# EasyEDA schematic SCH_CourseWorkMk_2022-09-30(2).json
TITLE: Sheet_1; REV: 1.0; Date: 2022-09-30; Sheet: 1/1; Drawn By: fzastahov; Company: Your Company
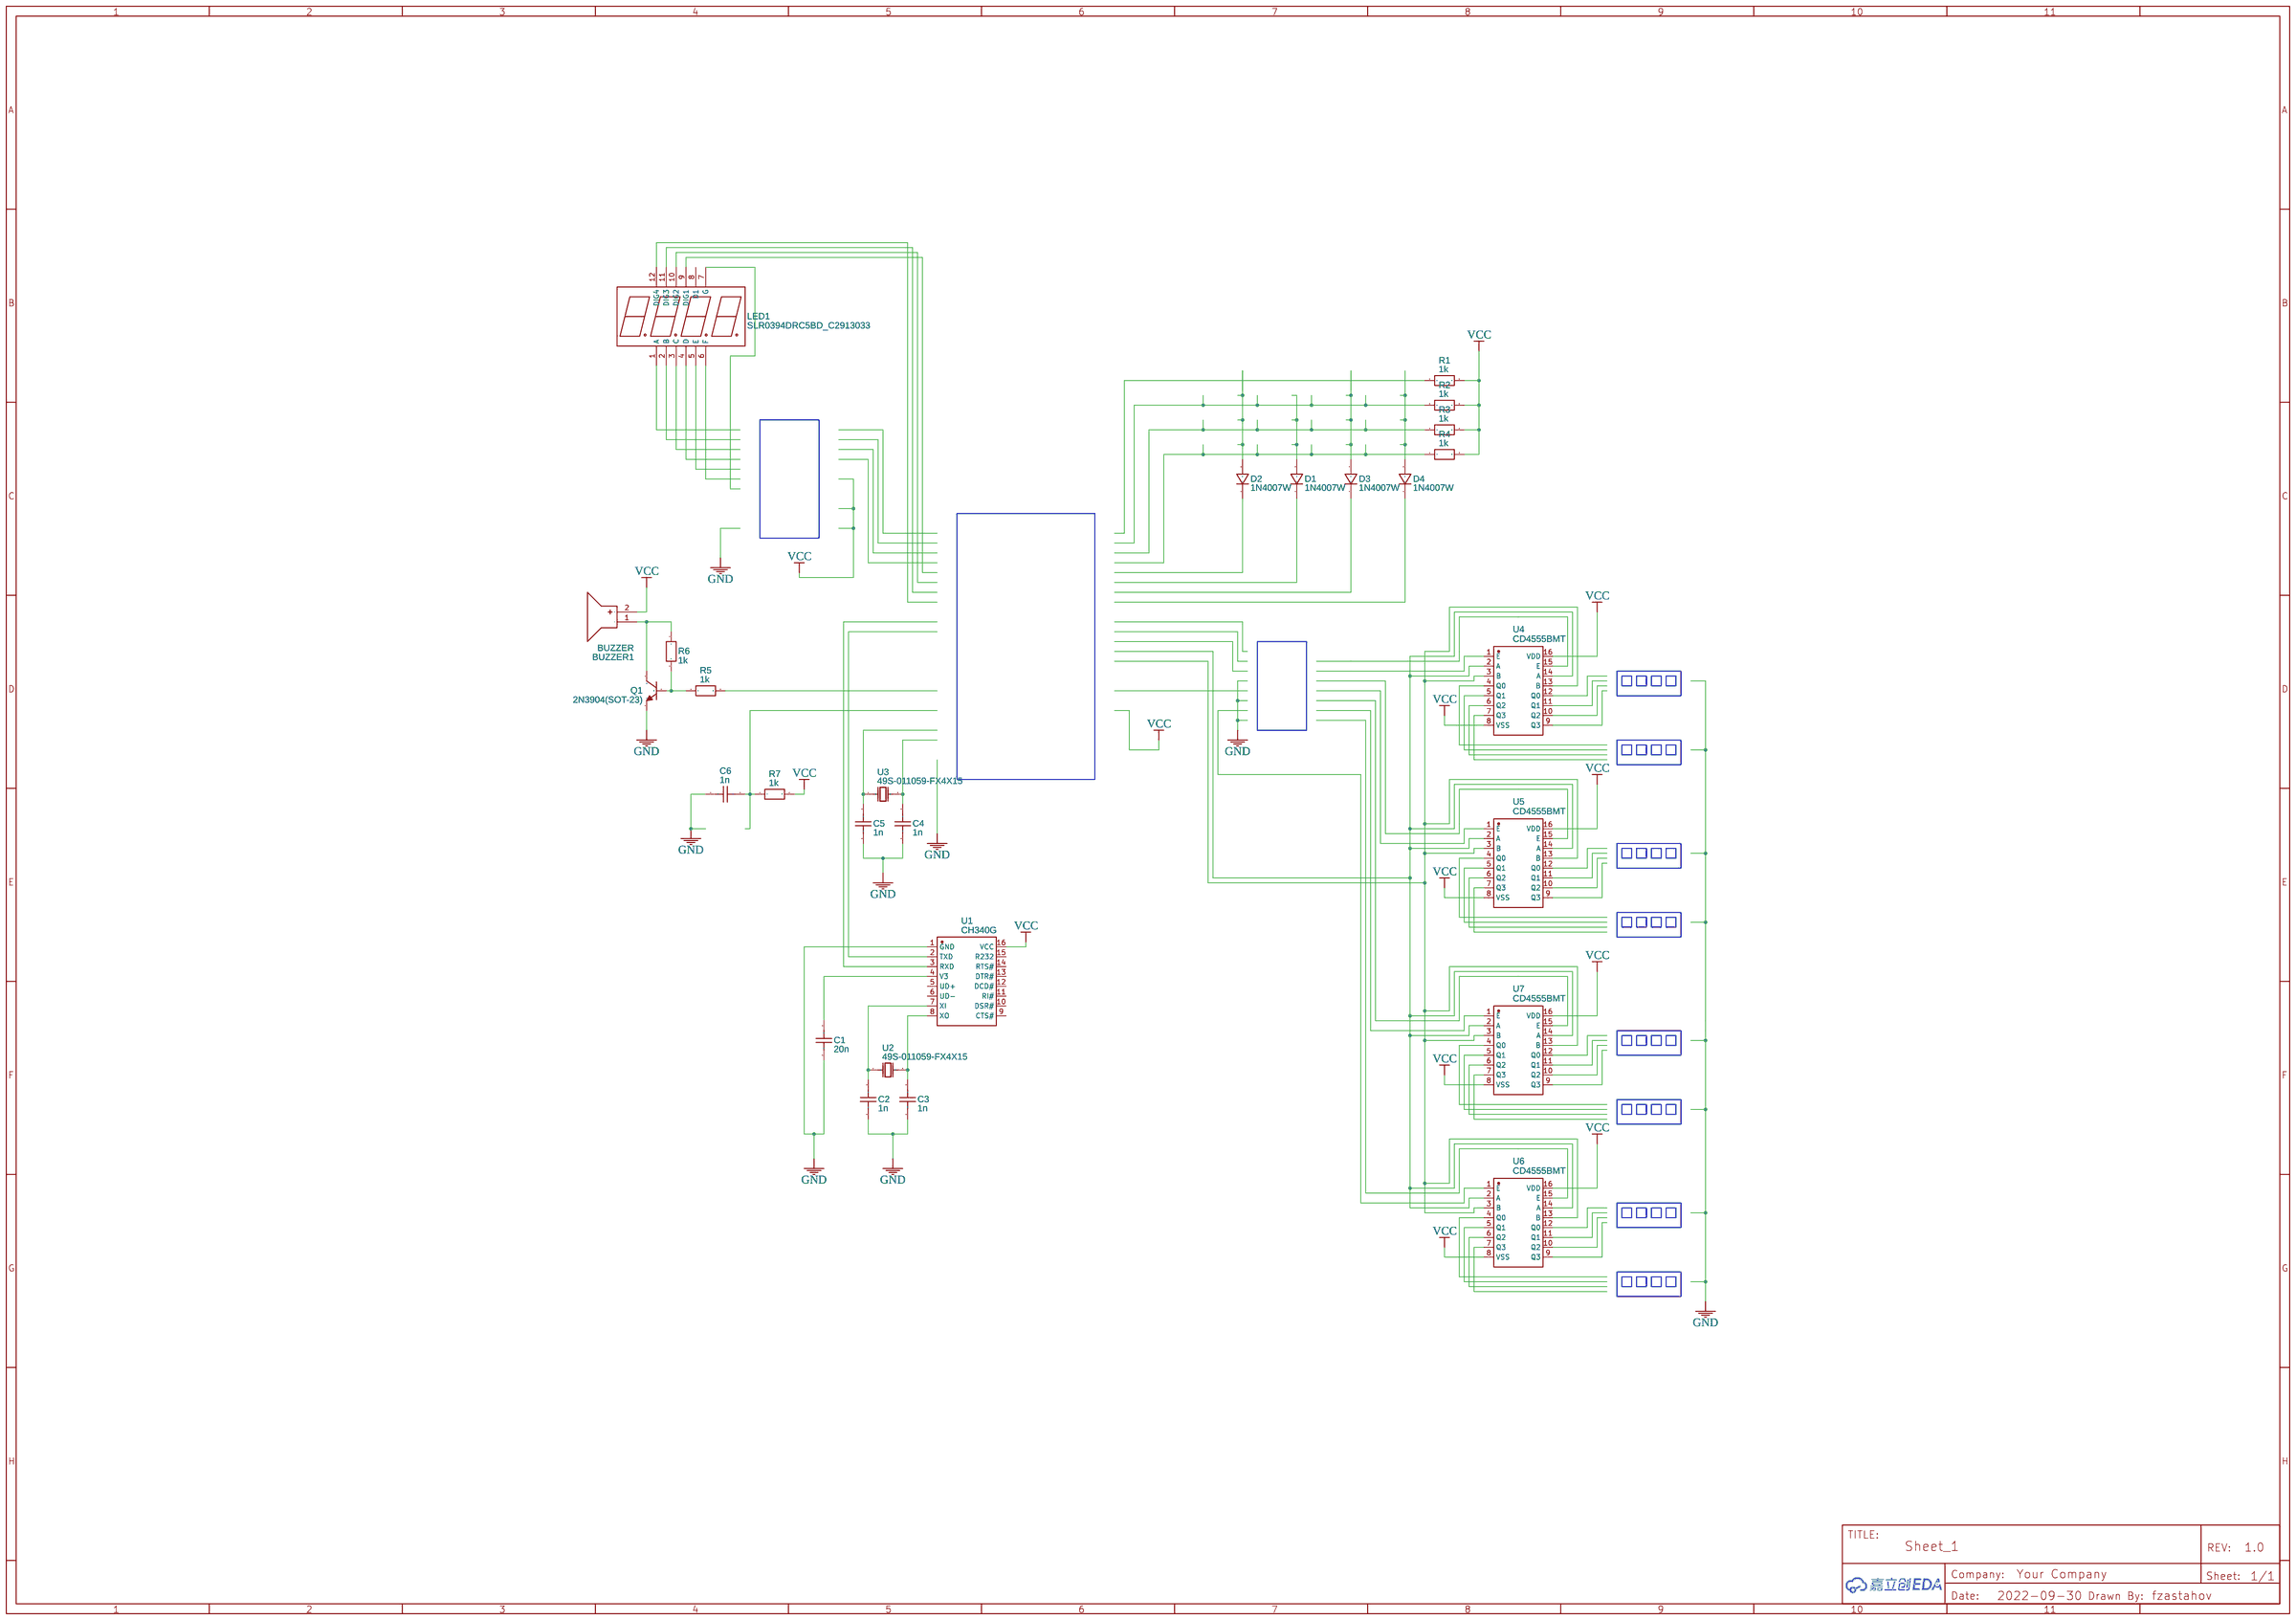
[diagram p0: schematic sheet]

## Parts
BUZZER1  BUZZER  [BUZ-TH_BD12.0-P6.00-D0.9-RD]
C1  20n  [C0603]
C2  1n  [C0603]
C3  1n  [C0603]
C4  1n  [C0603]
C5  1n  [C0603]
C6  1n  [C0603]
D1  1N4007W  [SOD-123_L2.8-W1.8-LS3.7-RD]
D2  1N4007W  [SOD-123_L2.8-W1.8-LS3.7-RD]
D3  1N4007W  [SOD-123_L2.8-W1.8-LS3.7-RD]
D4  1N4007W  [SOD-123_L2.8-W1.8-LS3.7-RD]
LED1  SLR0394DRC5BD_C2913033  [LED-SEG-TH_SLR0394DRC5BD]
Q1  2N3904(SOT-23)  [SOT-23-3_L2.9-W1.3-P1.90-LS2.4-TR]
R1  1k  [R0603]
R2  1k  [R0603]
R3  1k  [R0603]
R4  1k  [R0603]
R5  1k  [R0603]
R6  1k  [R0603]
R7  1k  [R0603]
U1  CH340G  [SOIC-16_L9.9-W3.9-P1.27-LS6.0-BL]
U2  49S-011059-FX4X15  [HC-49S_L11.5-W5.0-P4.88]
U3  49S-011059-FX4X15  [HC-49S_L11.5-W5.0-P4.88]
U4  CD4555BMT  [SOIC-16_L9.9-W3.9-P1.27-LS6.0-BL]
U5  CD4555BMT  [SOIC-16_L9.9-W3.9-P1.27-LS6.0-BL]
U6  CD4555BMT  [SOIC-16_L9.9-W3.9-P1.27-LS6.0-BL]
U7  CD4555BMT  [SOIC-16_L9.9-W3.9-P1.27-LS6.0-BL]

## Library data of the parts
BUZZER1 = BUZZER: Supplier: LCSC; Supplier Part: C9900014030; Manufacturer: null; Manufacturer Part: buzzer; JLCPCB Part Class: Extended Part; Contributor: lcsc
C1-C6 = C_0603_US: Contributor: LCEDA_Lib
D1-D4 = 1N4007W: Supplier: LCSC; Supplier Part: C328592; Manufacturer: BLUE ROCKET; Contributor: LCEDA_Lib
LED1 = SLR0394DRC5BD_C2913033: Supplier: LCSC; Supplier Part: C2913033; Manufacturer: SUNLIGHT(光华); Manufacturer Part: SLR0394DRC5BD; Contributor: LCSC
Q1 = 2N3904(SOT-23): Supplier: LCSC; Manufacturer: KEC; Manufacturer Part: 2n3904S-RTK/PS; Supplier Part: C18536; Paste Type: SOT-23; Contributor: LCEDA_Lib
R1-R7 = R_0603_EU: Contributor: LCEDA_Lib
U1 = CH340G: Supplier: LCSC; Manufacturer: WCH; Supplier Part: C14267; JLCPCB Part Class: Extended Part
U2 U3 = 49S-011059-FX4X15: Supplier: LCSC; Supplier Part: C470253; Manufacturer: AKER(安碁科技); link: https://atta.szlcsc.com/upload/public/pdf/source/20191216/C470253_0719EE1FE34FA0ABCCF08E6CE5115E80.pdf; Contributor: lcsc
U4-U7 = CD4555BMT: Supplier: LCSC; Supplier Part: C1879855; Manufacturer: TI(德州仪器); Contributor: LCSC

## Nets
GND: C1.2 C2.2 C3.2 C4.2 C5.2 C6.1 Q1.1(E) U1.1(GND)
VCC: BUZZER1.2(+) R1.2 R2.2 R3.2 R4.2 R7.2 U1.16(VCC) U4.8(VSS) U4.16(VDD) U5.8(VSS) U5.16(VDD) U6.8(VSS) U6.16(VDD) U7.8(VSS) U7.16(VDD)
Net-(BUZZER1-1): BUZZER1.1(-) Q1.3(C) R6.1
Net-(C1-1): C1.1 U1.4(V3)
Net-(C2-1): C2.1 U1.7(XI) U2.1(OSC1)
Net-(C3-1): C3.1 U1.8(XO) U2.2(OSC2)
Net-(C4-1): C4.1 U3.2(OSC2)
Net-(C5-1): C5.1 U3.1(OSC1)
Net-(C6-2): C6.2 R7.1
Net-(Q1-2): Q1.2(B) R5.1 R6.2
Net-(U4-2): U4.2(A) U4.14(A) U5.2(A) U5.14(A) U6.2(A) U6.14(A) U7.2(A) U7.14(A)
Net-(U4-3): U4.3(B) U4.13(B) U5.3(B) U5.13(B) U6.3(B) U6.13(B) U7.3(B) U7.13(B)

Not connected (* = marked no-connect by the designer): D1 1 2; D2 1 2; D3 1 2; D4 1 2; LED1 1(A) 2(B) 3(C) 4(D) 5(E) 6(F) 7(G) 8(D1) 9(DIG1) 10(DIG2) 11(DIG3) 12(DIG4); R1 1; R2 1; R3 1; R4 1; R5 2; U1 2(TXD) 3(RXD) 5(UD+) 6(UD-) 9(CTS#) 10(DSR#) 11(RI#) 12(DCD#) 13(DTR#) 14(RTS#) 15(R232); U4 1(E) 4(Q0) 5(Q1) 6(Q2) 7(Q3) 9(Q3) 10(Q2) 11(Q1) 12(Q0) 15(E); U5 1(E) 4(Q0) 5(Q1) 6(Q2) 7(Q3) 9(Q3) 10(Q2) 11(Q1) 12(Q0) 15(E); U6 1(E) 4(Q0) 5(Q1) 6(Q2) 7(Q3) 9(Q3) 10(Q2) 11(Q1) 12(Q0) 15(E); U7 1(E) 4(Q0) 5(Q1) 6(Q2) 7(Q3) 9(Q3) 10(Q2) 11(Q1) 12(Q0) 15(E)
